# EAGLE schematic encoder_avr (EAGLE 6.3)
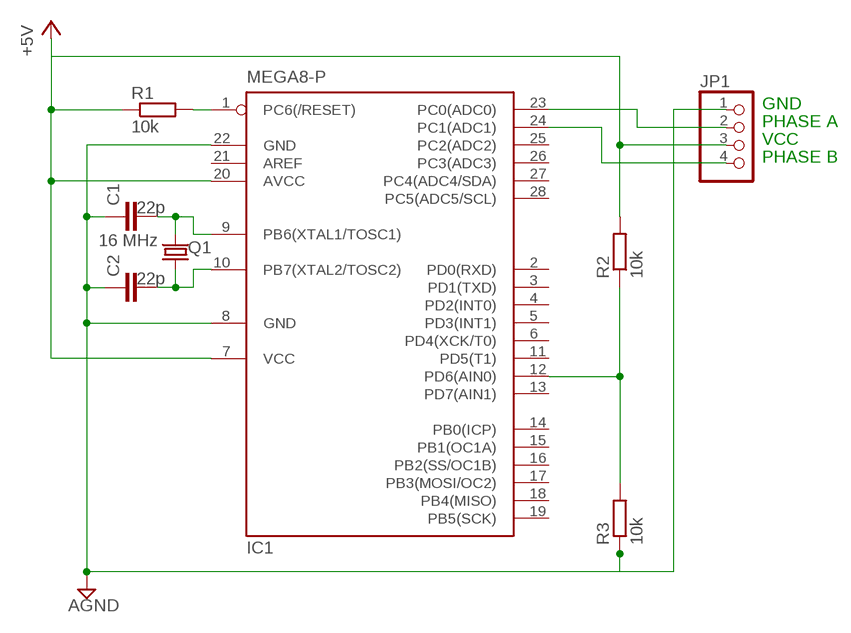
[diagram p0: schematic, sheet 1]

## Parts
C1  22p  C-EU050-024X044  [C050-024X044]
C2  22p  C-EU050-024X044  [C050-024X044]
IC1  MEGA8-P  [DIL28-3]
JP1  PINHD-1X4  [1X04]
Q1  16 MHz  CRYSTALHC49S  [HC49/S]
R1  10k  R-EU_0207/10  [0207/10]
R2  10k  R-EU_0207/10  [0207/10]
R3  10k  R-EU_0207/10  [0207/10]

## Nets
+5V: IC1.7(VCC) IC1.20(AVCC) JP1.3 R1.1 R2.2
AGND: C1.1 C2.1 IC1.8(GND) IC1.22(GND) JP1.1 R3.1
N$1: IC1.1(PC6(/RESET)) R1.2
N$2: C1.2 IC1.9(PB6(XTAL1/TOSC1)) Q1.2
N$3: C2.2 IC1.10(PB7(XTAL2/TOSC2)) Q1.1
N$4: IC1.12(PD6(AIN0)) R2.1 R3.2
N$6: IC1.23(PC0(ADC0)) JP1.2
N$7: IC1.24(PC1(ADC1)) JP1.4
Unconnected: IC1.2(PD0(RXD)) IC1.3(PD1(TXD)) IC1.4(PD2(INT0)) IC1.5(PD3(INT1)) IC1.6(PD4(XCK/T0)) IC1.11(PD5(T1)) IC1.13(PD7(AIN1)) IC1.14(PB0(ICP)) IC1.15(PB1(OC1A)) IC1.16(PB2(SS/OC1B)) IC1.17(PB3(MOSI/OC2)) IC1.18(PB4(MISO)) IC1.19(PB5(SCK)) IC1.21(AREF) IC1.25(PC2(ADC2)) IC1.26(PC3(ADC3)) IC1.27(PC4(ADC4/SDA)) IC1.28(PC5(ADC5/SCL))

## Notes on the sheet
- GND
- PHASE A
- VCC
- PHASE B

## Library data of the parts
C1 C2 = resistor:C-EU: CAPACITOR, European symbol
IC1 = atmel:MEGA8-P: MICROCONTROLLER 8 Kbytes FLASH, 1 kbytes SRAM, 512 bytes EEPROM, USART, 4-channel 10 bit ADC, 2-channel 8 bit ADC Pin compatible with Atmega48, ATMega88, ATMega168 Source: avr.lbr; OC_FARNELL: unknown; OC_NEWARK: unknown
JP1 = pinhead:PINHD-1X4: PIN HEADER
Q1 = crystal:CRYSTAL: CRYSTAL; OC_FARNELL: 1667008; OC_NEWARK: unknown
R1-R3 = resistor:R-EU_: RESISTOR, European symbol